# Altium schematic sheet bbr18_thrower_board.SchDoc
size A4
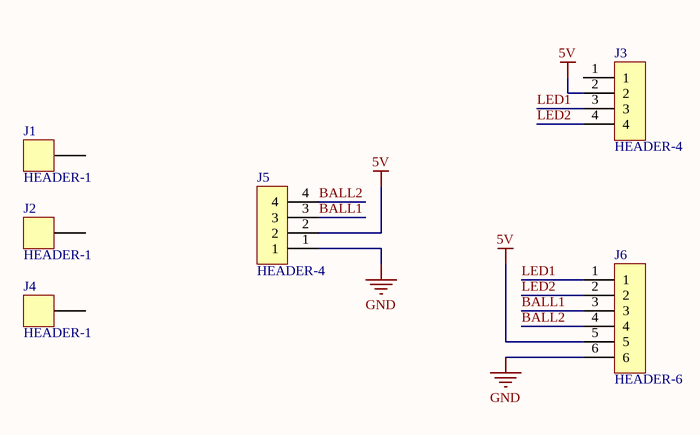
[diagram p0: bbr18_thrower_board.SchDoc]

## Parts
J1  HEADER-1  [2MM-BULLET-PLUG-VIA]
J2  HEADER-1  [2MM-BULLET-PLUG-VIA]
J3  HEADER-4  [MICRO-MATCH-FOB-SIDE-04]
J4  HEADER-1  [2MM-BULLET-PLUG-VIA]
J5  HEADER-4  [MICRO-MATCH-MOB-04]
J6  HEADER-6  [MICRO-MATCH-FOB-SIDE-06]

## Nets
5V: J3.2 J5.2 J6.5
GND: J5.1 J6.6
BALL1: J5.3 J6.3
BALL2: J5.4 J6.4
LED1: J3.3 J6.1
LED2: J3.4 J6.2

Not connected (* = marked no-connect by the designer): J1 1; J2 1; J3 1; J4 1